# EAGLE schematic ESP32LiPoUSB (EAGLE 9.3.2)
COMPANY: ADAFRUIT INDUSTRIES; DRAWN: KTOWN; REV: B
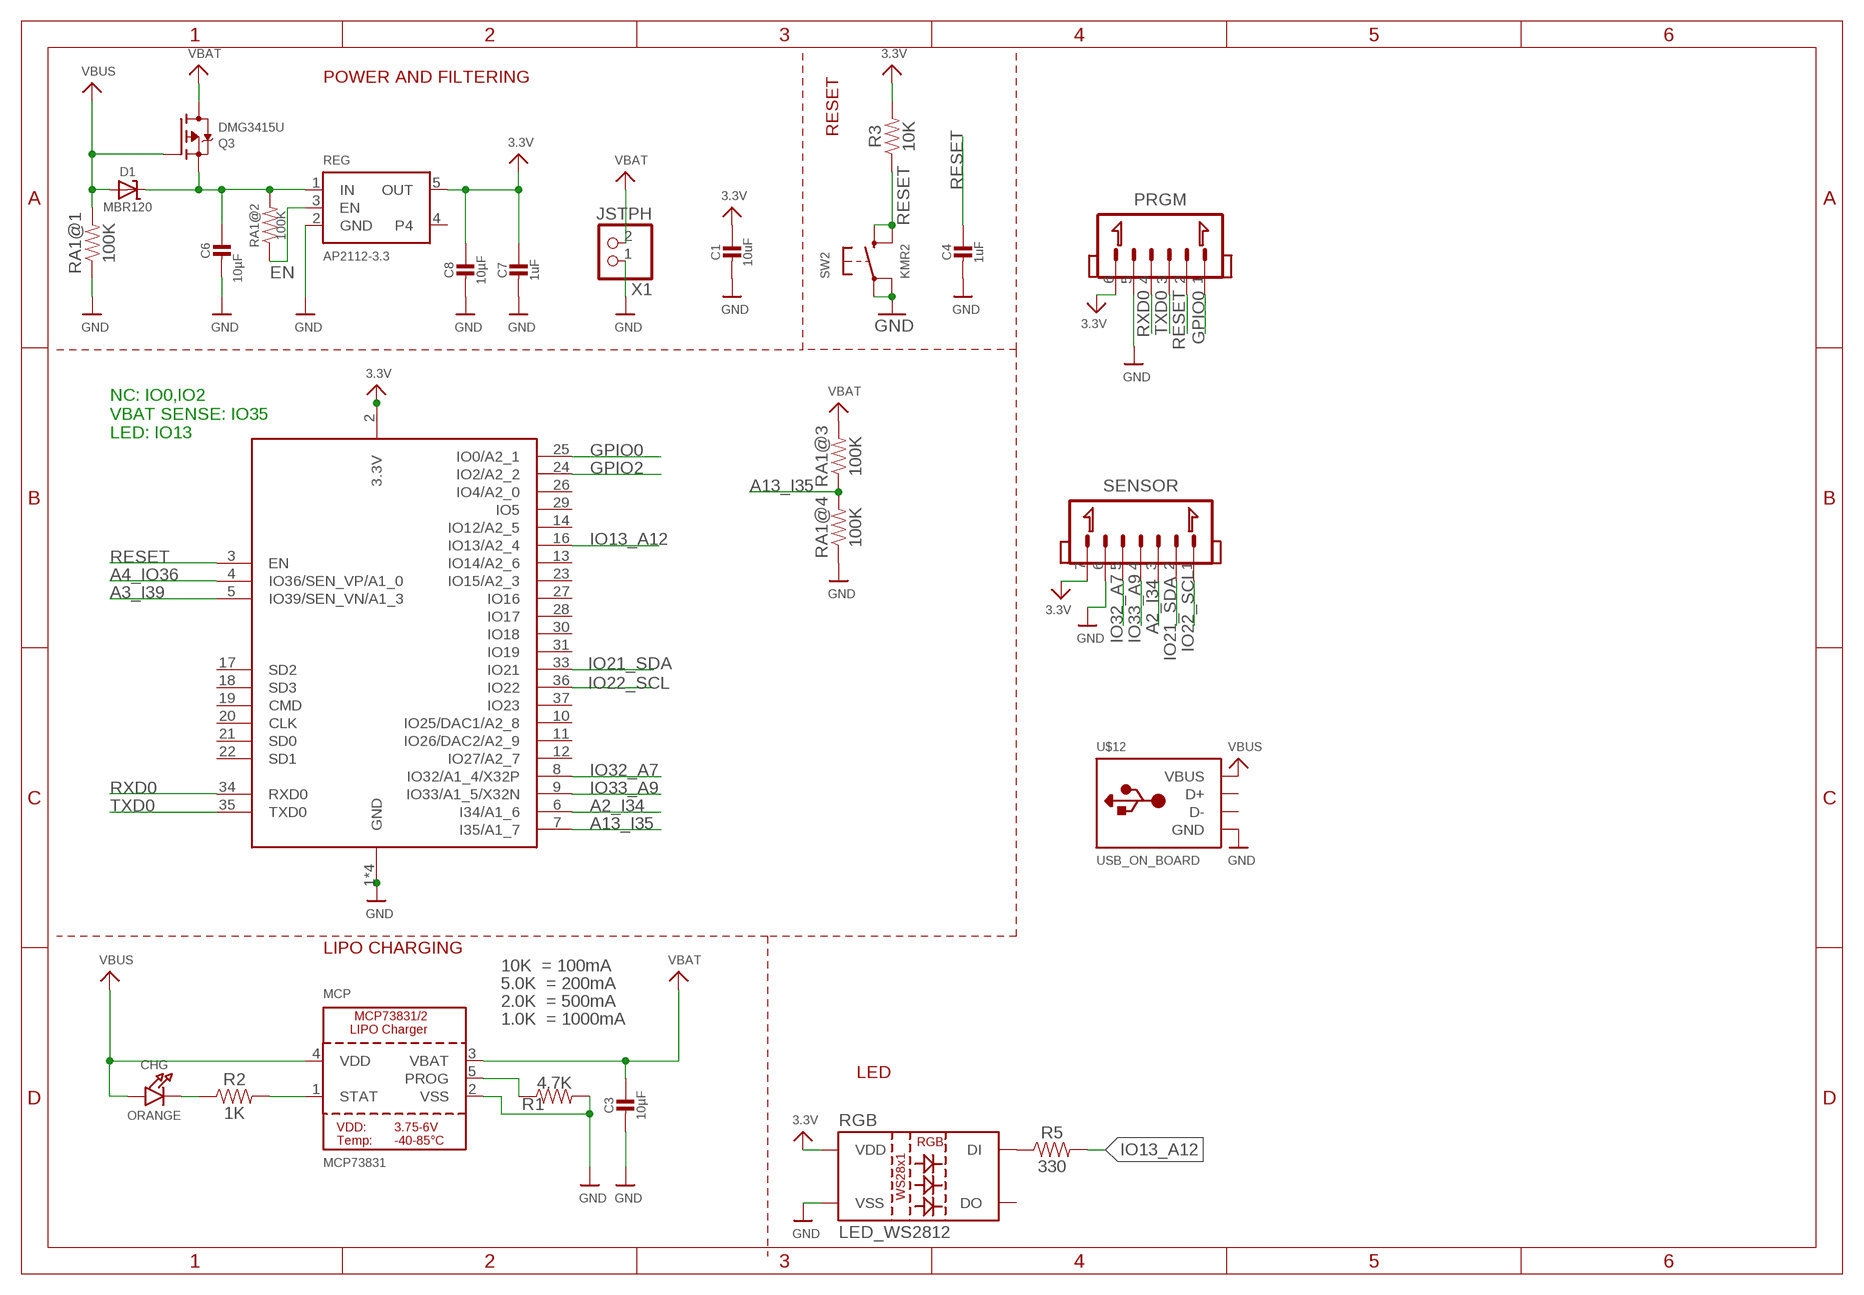
[diagram p0: schematic, sheet 1]

## Parts
C1  10uF  CAP_CERAMIC_0805  [CAP_0805]
C3  10µF  CAP_CERAMIC_0805  [CAP_0805]
C4  1uF  CAP_CERAMIC_0603  [CAP_0603]
C6  10µF  CAP_CERAMIC_0603  [CAP_0603]
C7  1uF  CAP_CERAMIC_0603  [CAP_0603]
C8  10µF  CAP_CERAMIC_0805  [CAP_0805]
CHG  ORANGE  LED0603  [MICROBUILDER_CHIPLED_0603]
D1  MBR120  DIODE-SCHOTTKYSOD-123  [SOD-123]
MCP  MCP73831  MCP73831/2  [SOT23-5]
PRGM  JST_1.25_6P  [JST1.25_6P]
Q3  DMG3415U  MOSFET-P  [SOT23-R]
R1  4.7K  RESISTOR0603  [0603]
R2  1K  RESISTOR0603  [0603]
R3  10K  RESISTOR0603  [0603]
R5  330  RESISTOR0603  [0603]
RA1  100K  RESISTOR_ARRAY_1206_SEPARATE  [RESCAF80P320X160X60-8N]
REG  AP2112-3.3  VREG_SOT23-5  [SOT23-5]
RGB  LED_WS2812  [LED-TRICOLOR-5050-IC]
SENSOR  JST_1.25_7P  [JST1.25_7P]
SW2  KMR2  SWITCH_TACT_SMT4.6X2.8  [BTN_KMR2_4.6X2.8]
U$12  USB_ON_BOARD  [USB_ON_BOARD]
X1  JSTPH  CON_JST_PH_2PIN  [JSTPH2]
X2  ESP32_WROOM32_SKINNY  [WROOM32_SKINNY]

## Nets
3.3V: C1.1 C7.1 C8.1 PRGM.6 R3.2 REG.5(OUT) RGB.VDD SENSOR.7 X2.2(3.3V)
A2_I34: SENSOR.3 X2.6(I34/A1_6)
A3_I39: X2.5(IO39/SEN_VN/A1_3)
A4_IO36: X2.4(IO36/SEN_VP/A1_0)
A13_I35: RA1.3 RA1.8 X2.7(I35/A1_7)
EN: RA1.2 REG.3(EN)
GND: C1.2 C3.2 C4.2 C6.2 C7.2 C8.2 MCP.2(VSS) PRGM.5 R1.2 RA1.1 RA1.4 REG.2(GND) RGB.VSS SENSOR.6 SW2.A'(P1) SW2.A(P) U$12.GND X1.1 X2.1(GND) X2.15(GND) X2.38(GND) X2.P$1(GND)
GPIO0: PRGM.1 X2.25(IO0/A2_1)
GPIO2: X2.24(IO2/A2_2)
IO13_A12: R5.2 X2.16(IO13/A2_4)
IO21_SDA: SENSOR.2 X2.33(IO21)
IO22_SCL: SENSOR.1 X2.36(IO22)
IO32_A7: SENSOR.5 X2.8(IO32/A1_4/X32P)
IO33_A9: SENSOR.4 X2.9(IO33/A1_5/X32N)
N$1: CHG.C R2.1
N$2: R5.1 RGB.DIN(DI)
N$3: MCP.1(STAT) R2.2
N$4: MCP.5(PROG) R1.1
N$7: C6.1 D1.C Q3.2(S) RA1.6 REG.1(IN)
RESET: C4.1 PRGM.2 R3.1 SW2.B'(S1) SW2.B(S) X2.3(EN)
RXD0: PRGM.4 X2.34(RXD0)
TXD0: PRGM.3 X2.35(TXD0)
VBAT: C3.1 MCP.3(VBAT) Q3.3(D) RA1.7 X1.2
VBUS: CHG.A D1.A MCP.4(VDD) Q3.1(G) RA1.5 U$12.VCC(VBUS)
Unconnected: REG.4 RGB.DOUT(DO) U$12.D+ U$12.D- X2.10(IO25/DAC1/A2_8) X2.11(IO26/DAC2/A2_9) X2.12(IO27/A2_7) X2.13(IO14/A2_6) X2.14(IO12/A2_5) X2.17(SD2) X2.18(SD3) X2.19(CMD) X2.20(CLK) X2.21(SD0) X2.22(SD1) X2.23(IO15/A2_3) X2.26(IO4/A2_0) X2.27(IO16) X2.28(IO17) X2.29(IO5) X2.30(IO18) X2.31(IO19) X2.37(IO23)

## Notes on the sheet
- POWER AND FILTERING
- RESET
- NC: IO0,IO2
  VBAT SENSE: IO35
  LED: IO13
- LIPO CHARGING
- 10K  = 100mA
- 5.0K  = 200mA
- 2.0K  = 500mA
- 1.0K  = 1000mA
- LED

## Library data of the parts
C1 C3 C4 C6-C8 = Scott-Electrical:CAP_CERAMIC
CHG = Scott-Electrical:LED: LED 0603 - 0603 Surface Mount Package 2mA: Green LED - Low Power (3.9mcd, 2ma, 1.7Vf) - Digikey: 475-2709-2-ND Orange LED - Low Power (9.8mcd, 2ma, 1.8Vf) - Digikey: 475-1194-2-ND Red LED - Low Power (5mcd, 2ma, 1.8Vf) - Digikey: 475-1195-2-ND Yellow LED - Low Power (7mcd, 2ma, 1.8Vf) - Digikey: 475-1196-2-ND 5mA: Blue LED - Low Power (17mcd, 5ma, 2.9Vf) - Digikey: LNJ937W8CRACT-ND 0805 - 0805 Surface Mount Package 2mA: Red LED (8.8mcd, 2mA, 1.8Vf, Clear) - Low Power [Digikey: 475-2510-1-ND] Green LED (5mcd, 2mA, 1.8Vf, Clear) - Low Power [Digikey: 475-2730-1-ND] Yellow LED (11.3mcd, 2mA, 1.8Vf, Clear) - Low Power [Digikey: 475-2555-1-ND] 20mA: Red LED (104mcd, 20mA, Diffused) - LS R976 [Digikey: 475-1278-6-ND] Red LED (12mcd, 20mA, 2.0Vf, Clear) - APT2012EC [Digikey: 754-1128-1-ND] Green LED (15mcd, 20mA, 2.2Vf, Clear) - APT2012GC [Digikey: 754-1131-1-ND] Orange LED (160mcd, 20mA, 2.1Vf, Clear) - APT2012SECK [Digikey: 754-1130-1-ND] 1206 - 1206 Surface Mount Package Green LED (26mcd, 20mA, Diffused) - LG N971 [Digikey: 475-1407-6-ND] Red LED (15mcd, 20mA, Diffused) - LH N974 [Digikey: 475-1416-6-ND] Cree - Cree High-Power Surface Mount LEDs XPEBWT-L1-0000-00D50 - White 111lm 350mA 2.9Vf 6200K 110° XTEAWT-00-0000-00000LEE3 - White 114lm 350mA 2.85Vf 5000K 115° Everlight - Everlight 45-21 Series Surface Mount LEDs 45-21/QK2C-B2832AC2CB2/2T - Warm White 2000mcd 20mA 3.25Vf 3050K 120° 45-21/LK2C-B38452C4CB2/2T - Nuetral White 2000mcd 20mA 3.25Vf 4150K 120° 45-21/LK2C-B50634C6CB2/2T - Cold White 2200mcd 20mA 3.25Vf 5650K 120° PLCC2 Reverse Mount LS T77K-J1L2-1-0-2-R18-Z - Red 11.25mcd 2mA 1.8Vf 630nm 120° LO T77K-L1M2-24-Z - Orange 19.6mcd 2mA 1.8Vf 606nm 120° LY T77K-K2M1-26-Z - Yellow 15.7mcd 2mA 1.8Vf 587nm 120°
D1 = microbuilder:DIODE-SCHOTTKY
MCP = microbuilder:MCP73831/2: MCP73831/2 LIPO Charger VDD: 3.75 - 6V Temp -40 - 85°C Programmable Charge Rate: 15-500mA NOTE: STAT is a tri-state logic output on the MCP73831 and an open-drain output on the MCP73832. SOT23-5 with 4.2V output and tri-state logic on STAT = MCP73831T-2ACI/OT
PRGM = Scott-Connectors:JST_1.25_6P
Q3 = microbuilder:MOSFET-P: P-Channel Mosfet LEGEND VDS: Voltage Drain-Source ID: Drain Current RDS(ON): Drain-Source On-State Resistance VGS(TH): Gate-Source Threshold Voltage CISS: Drain-Source Input Capacitance SOT-23 Name VDS ID RDS(ON) VGS(TH) CISS Order Number IRLML5103 30V 760mA 600 mOhm -- 75pF @ 25V Digikey: IRLML5103PBFCT-ND IRLML6401 12V 4.3A 50 mOhm 950mV @ 250µA 830pF @ 10V Digikey: IRLML6401PBFTR-ND NTR0202PL 20V 400mA 800 mOhm 2.3V @ 250uA 70pF @ 5V Digikey: NTR0202PLT1GOSTR-ND NTR4101PT1G 20V 1.8A 85 mOhm 1.2V @ 250uA 675pF @ 10V Digikey: NTR4101PT1GOSCT-ND DMP2004K 20V 600mA 900 mOhm 1V @ 250uA 175pF @ 16V Digikey: DMP2004KDICT-ND PMV65XP 20V 3.9A 76 mOhm 950mV @ 1mA 725pF @ 20V Digikey: 568-2358-2-ND TO-252 Name VDS ID RDS(ON) VGS(TH) CISS Order Number AOD417 30V 25A 34 mOhm 3V @ 250µA 920pF @ 15V Digikey: 785-1106-2-ND PowerPak Name VDS ID RDS(ON) VGS(TH) CISS Order Number AON7401 30V 12A 14 mOhm 3V @ 250µA 2600pF @ 15V Digikey: 785-1302-1-ND
R1-R3 R5 = Scott-Electrical:RESISTOR: Generic Resistor Package
RA1 = Scott-Electrical:RESISTOR_ARRAY_1206_SEPARATE
REG = microbuilder:VREG_SOT23-5: SOT23-5 Fixed Voltage Regulators Part Current Out V Out V In V Dropout θJA (°C/W) TJ (°C) Digikey Part No. ADP121 150mA 3.3V 3.4-5.5V 0.09V @ 150mA -- -- ADP121-AUJZ33R7CT-ND ADP121 150mA 3.0V 3.1-5.5V 0.09V @ 150mA -- -- ADP121-AUJZ30R7CT-ND ADP122 300mA 3.3V 3.4-5.5V 0.085V @ 300mA -- -- ADP122AUJZ-3.3-R7CT-ND ADP1712 300mA 3.3V 3.5-5.5V 0.17V @ 300mA -- -- ADP1712AUJZ-3.3-R7TR-ND AP7311 (Low Cost) 150mA 3.3V 3.5-6V 0.15V @ 150mA -- -- AP7311-33WG-7DICT-ND LD39015M18R 150mA 1.8V 1.9V-5.5V 0.08V @ 100mA -- -- 497-6977-1-ND LP2985A-33DBVR 150mA 3.3V 3.3-16V 0.28V @ 150mA 206 150 296-18479-1-ND MCP1824T-3302E/OT 300mA 3.3V 3.5V-6V 0.2V @ 300mA -- -- MCP1824T-3302E/OTCT-ND MIC5205-2.5YM5 TR 150mA 2.5V 2.7-16V 0.165V @ 150mA -- -- 576-1257-2-ND MIC5205-3.0YM5 TR 150mA 3.0V 3.2V-16V 0.165V @ 150mA -- -- 576-1258-2-ND MIC5205-3.3YM5 TR 150mA 3.3V 3.5V-16V 0.165V @ 150mA -- -- 576-1259-2-ND TPS780330220 150mA 3.3V+2.2V 3.6-5.5V 250mV Max -- -- 296-23332-1-ND TDA3663/N1,135 100mA 3.3V 3.5-45V 0.18V @ 50mA -- -- 568-5343-1-ND Max operating temp can be calculated using θJA, TJ (max junction temperature), and power in watts. Set the "Maximum Ambient Temperature" until it reaches TJ ("Max Junction Temperature"), which is the absolute limit for safe use of the regulator: Heat Sink Temperature Calculator <http://www.daycounter.com/Calculators/Heat-Sink-Temperature-Calculator.phtml> For example, With 12V source into a 3.3V LP2985 and a 30mA load, we are dissipating (12V-3.3V) * 0.03A = 0.261W. With a θJA of 206 °C/W, a TJ of 150°C, and 261mW we can safely use the chip without a heat sink up to 75°C (=147.1°C Junction Temperature).
RGB = Scott-ICs:LED_WS2812
SENSOR = Scott-Connectors:JST_1.25_7P
SW2 = microbuilder:SWITCH_TACT_SMT: SMT Tact Switches 6x6mm - Digikey: P12940SCT-ND KMR2 (4.6x2.8mm) - Digikey: 401-1426-1-ND EVQ-PQHB55 - Light Touch, 160GF (4.5x4.5mm) - Digikey: P8090SCT-ND KMT0 - KMT021 NGJ LHS (etc.) IP68/Waterproof - Digikey: CKN10289CT-ND
U$12 = Scott-Connectors:USB_ON_BOARD
X1 = microbuilder:CON_JST_PH_2PIN: JST 2-Pin Right-Angle Connector PH-Series - 4UConnector: 17311 SH-Series - 4UConnector: 07278
X2 = microbuilder:ESP32_WROOM32